# Altium schematic sheet fisrt_project.SchDoc
size A4
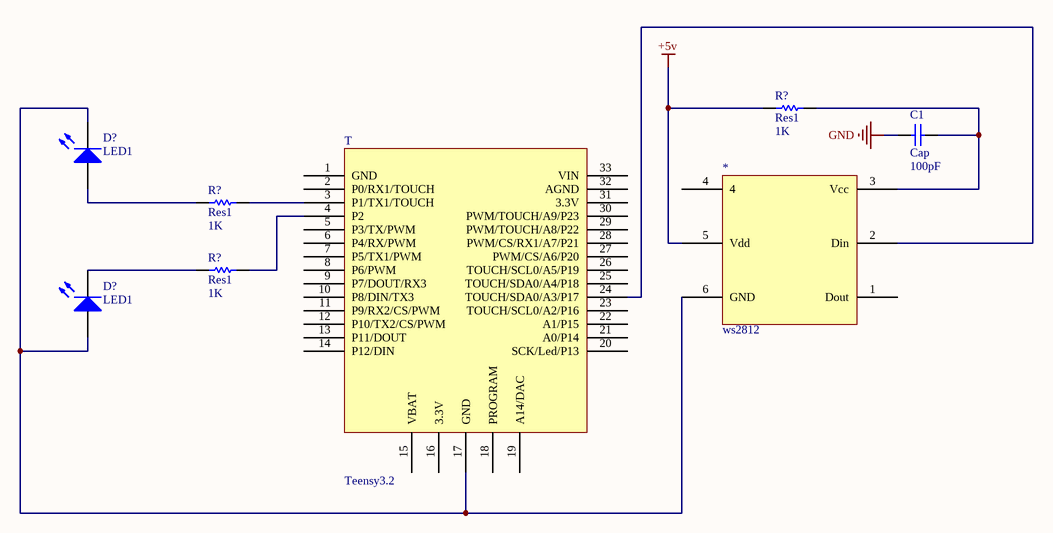
[diagram p0: fisrt_project.SchDoc]

## Parts
(Parts that share a designator on the sheet are numbered #1, #2 ... from top to bottom, then left to right.)
*  ws2812
C1  Cap  value 100pF  [RAD-0.3]
D?#1  LED1  [LED-1]
D?#2  LED1  [LED-1]
R?#1  Res1  value 1K  [AXIAL-0.3]
R?#2  Res1  value 1K  [AXIAL-0.3]
R?#3  Res1  value 1K  [AXIAL-0.3]
T  Teensy3.2  [Teensy3_2]

## Nets
+5v: *.5(Vdd) R?#1.1
GND: C1.1
Net*_2: *.2(Din) T.24(TOUCH/SDA0/A3/P17)
Net*_3: *.3(Vcc) C1.2 R?#1.2
Net*_6: *.6(GND) D?#1.2(K) D?#2.1(A) T.17(GND)
NetD?#1_1: D?#1.1(A) R?#2.1
NetD?#2_2: D?#2.2(K) R?#3.1
NetR?#2_2: R?#2.2 T.3(P1/TX1/TOUCH)
NetR?#3_2: R?#3.2 T.4(P2)

Not connected (* = marked no-connect by the designer): * 1(Dout) 4; T 1(GND) 2(P0/RX1/TOUCH) 5(P3/TX/PWM) 6(P4/RX/PWM) 7(P5/TX1/PWM) 8(P6/PWM) 9(P7/DOUT/RX3) 10(P8/DIN/TX3) 11(P9/RX2/CS/PWM) 12(P10/TX2/CS/PWM) 13(P11/DOUT) 14(P12/DIN) 15(VBAT) 16(3.3V) 18(PROGRAM) 19(A14/DAC) 20(SCK/Led/P13) 21(A0/P14) 22(A1/P15) 23(TOUCH/SCL0/A2/P16) 25(TOUCH/SDA0/A4/P18) 26(TOUCH/SCL0/A5/P19) 27(PWM/CS/A6/P20) 28(PWM/CS/RX1/A7/P21) 29(PWM/TOUCH/A8/P22) 30(PWM/TOUCH/A9/P23) 31(3.3V) 32(AGND) 33(VIN)

## Library data of the parts
C1 = Cap: Capacitor; Published: 8-Jun-2000; LatestRevisionDate: 17-Jul-2002; LatestRevisionNote: Re-released for DXP Platform.; PackageReference: RAD-0.3; Publisher: Altium Limited; PackageDescription: Radial Cap, Thru-Hole; 2 Leads; 0.3 in Pin Spacing
D?#1 D?#2 = LED1: Typical RED GaAs LED; Published: 8-Jun-2000; LatestRevisionDate: 08-Jul-2005; LatestRevisionNote: Mech Layer 1 removed.; PackageReference: LED-1; Publisher: Altium Limited; PackageDescription: LED; 2 Leads
R?#1-R?#3 = Res1: Resistor; Published: 8-Jun-2000; LatestRevisionDate: 17-Jul-2002; LatestRevisionNote: Re-released for DXP Platform.; PackageReference: AXIAL-0.3; Publisher: Altium Limited; PackageDescription: Axial Device, Thru-Hole; 2 Leads; 0.3 in Pin Spacing
T = Teensy_32: 32 Bit Arduino­Compatible Microcontroller